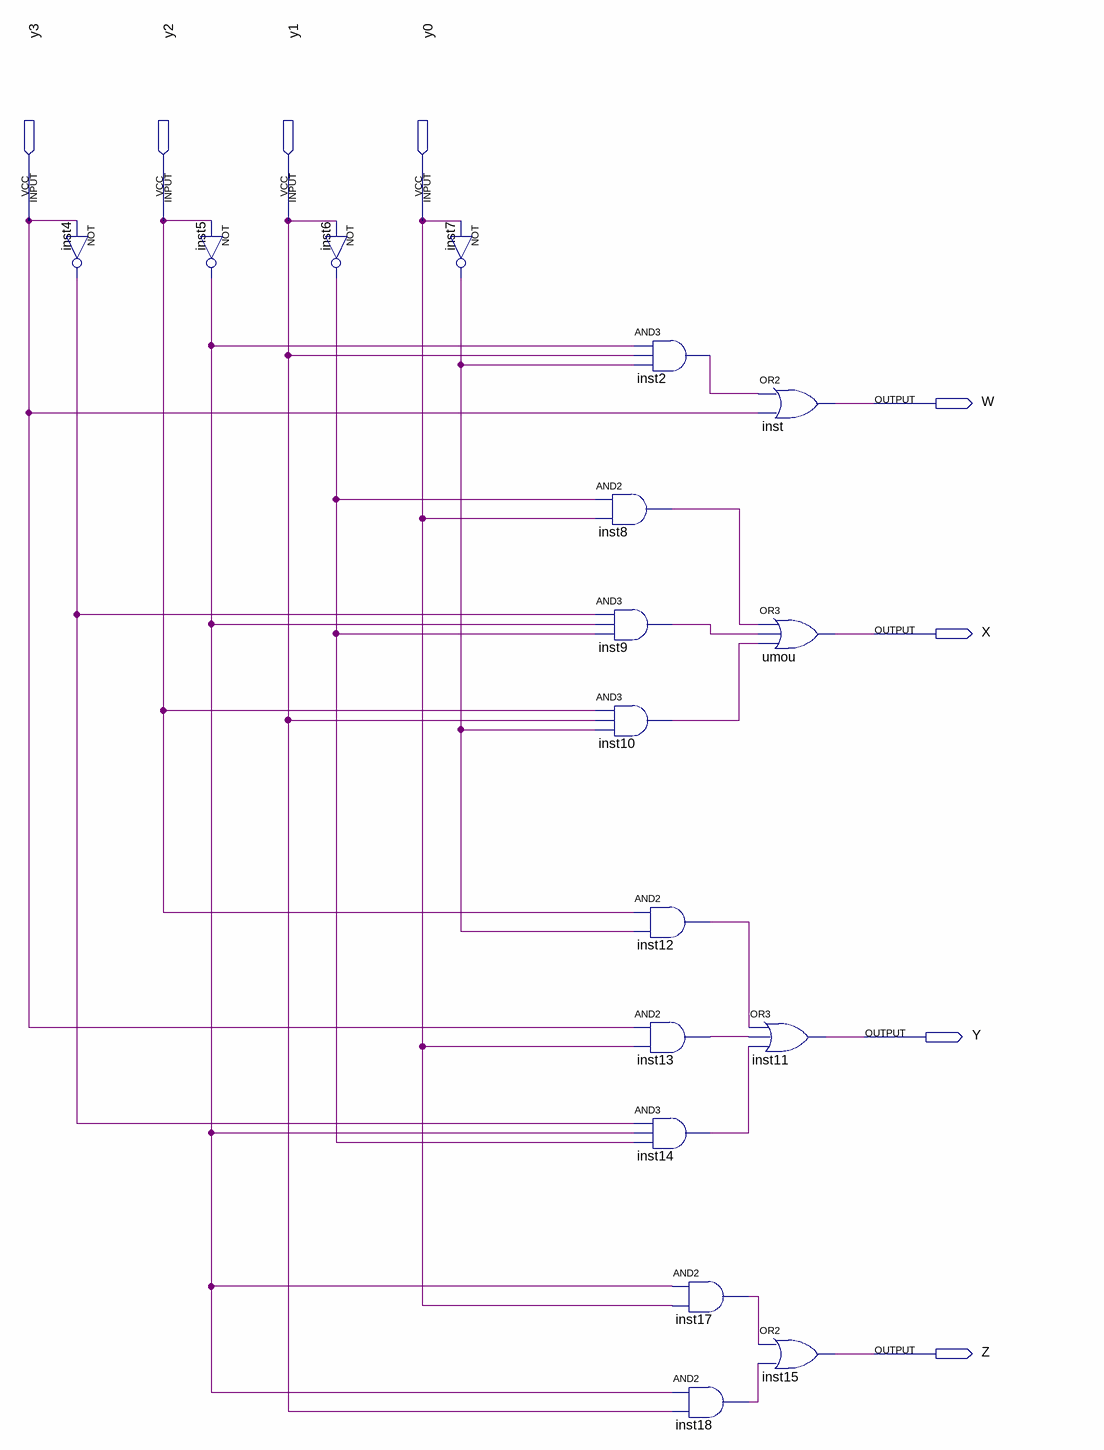
[diagram p0: schematic sheet]
// Quartus schematic CircuitoSaida.bdf as structural Verilog: 17 symbols, 8 pins
module CircuitoSaida (
  input  y3,
  input  y2,
  input  y1,
  input  y0,
  output W,
  output X,
  output Y,
  output Z
);

  wire inst2_out, inst4_out, inst5_out, inst6_out, inst7_out, inst8_out, inst9_out, inst10_out, inst12_out,
       inst13_out, inst14_out, inst17_out, inst18_out;

  not inst4 (inst4_out, y3);
  not inst5 (inst5_out, y2);
  not inst6 (inst6_out, y1);
  not inst7 (inst7_out, y0);
  and inst2 (inst2_out, inst5_out, y1, inst7_out);
  and inst8 (inst8_out, inst6_out, y0);
  and inst9 (inst9_out, inst4_out, inst5_out, inst6_out);
  and inst10 (inst10_out, y2, y1, inst7_out);
  and inst12 (inst12_out, y2, inst7_out);
  and inst13 (inst13_out, y3, y0);
  and inst14 (inst14_out, inst4_out, inst5_out, inst6_out);
  and inst17 (inst17_out, inst5_out, y0);
  and inst18 (inst18_out, inst5_out, y1);
  or inst (W, inst2_out, y3);
  or umou (X, inst8_out, inst9_out, inst10_out);
  or inst11 (Y, inst12_out, inst13_out, inst14_out);
  or inst15 (Z, inst17_out, inst18_out);
endmodule
